# Altium schematic sheet buck_converter.SchDoc
size A4; SheetNumber: 2; SheetTotal: 5
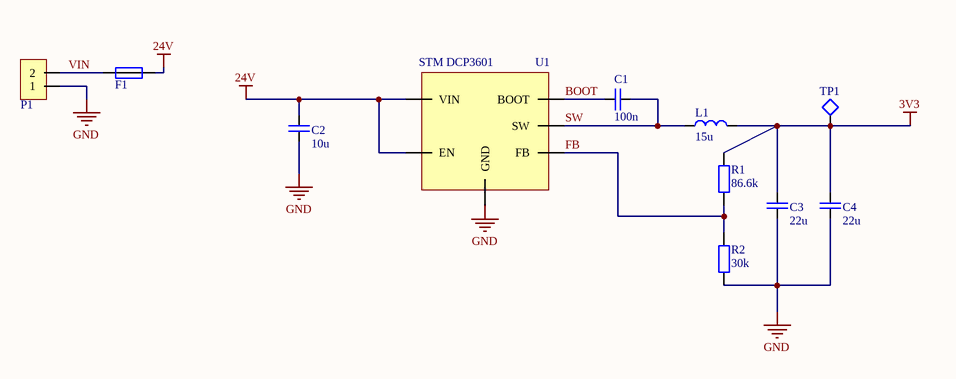
[diagram p0: buck_converter.SchDoc]

## Parts
C1  100n  [capacitor_smd_0603]
C2  10u  [capacitor_smd_1206]
C3  22u  [capacitor_smd_0805]
C4  22u  [capacitor_smd_0805]
F1  Fuse  [resisitor_smd_0603]  (value not drawn)
L1  15u  [inductor_smd_5mm8_x_5mm8]
P1  Terminal Block  [terminal_block_1X2_5mm08]  (value not drawn)
R1  86.6k  [resisitor_smd_0603]
R2  30k  [resisitor_smd_0603]
TP1  Test point  [test_point]  (value not drawn)
U1  STM DCP3601  [generic_sot23-6L]

## Nets
3V3: C3.1 C4.1 L1.2 R1.2 TP1.1
24V: C2.2 F1.1 U1.4(EN) U1.5(VIN)
GND: C2.1 C3.2 C4.2 P1.1 R2.2 U1.2(GND)
BOOT: C1.2 U1.1(BOOT)
FB: R1.1 R2.1 U1.3(FB)
SW: C1.1 L1.1 U1.6(SW)
VIN: F1.2 P1.2

## Library data of the parts
C1 = Capacitor - non-polarised: Vishay GA0603Y104KXAAC31G
C2 = Capacitor - non-polarised: Samsung CL31B106KBHNNNE
C3 C4 = Capacitor - non-polarised: TDK C2012X5R1V226M125AC
F1 = Fuse: Bourns SF-0603HI800M-2
L1 = Inductor: Bourns SRR5828A-150M
P1 = Terminal Block 1X2: Adam Tech EBAFA-02-D
R1 = Resistor: Panasonic ERA-3AEB8662V
R2 = Resistor: Panasonic ERA-3APB303V
U1 = STM DCP3601: STM DCP3601NDMR